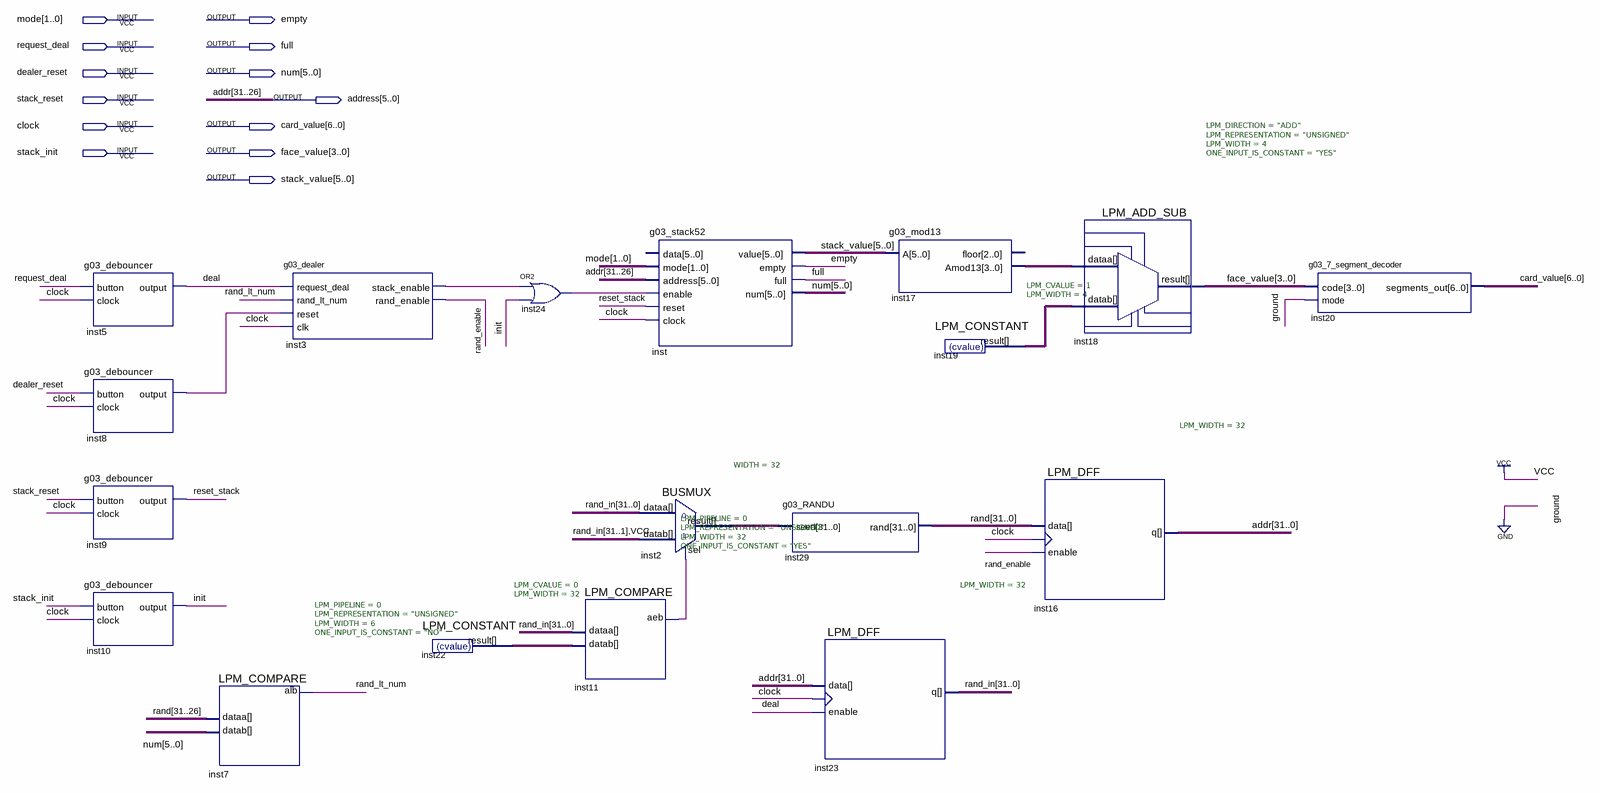
[diagram p0: schematic sheet]
// Quartus schematic g03_testbed_dealer_fixed.bdf as structural Verilog: 18 symbols, 13 pins
module g03_testbed_dealer_fixed (
  input  [1:0] mode,
  input  request_deal,
  input  dealer_reset,
  input  stack_reset,
  input  clock,
  input  stack_init,
  output empty,
  output full,
  output [5:0] num,
  output [5:0] address,
  output [6:0] card_value,
  output [3:0] face_value,
  output [5:0] stack_value
);

  wire deal, init, inst3_stack_enable, inst8_output, inst11_aeb, inst24_out, rand_enable, rand_lt_num,
       reset_stack;
  wire [3:0] inst17_amod13, inst19_result;
  wire [25:0] addr;
  wire [31:0] inst2_result, inst22_result, \rand , rand_in;

  g03_debouncer inst5 (.button(request_deal), .clock(clock), .\output (deal));
  g03_debouncer inst8 (.button(dealer_reset), .clock(clock), .\output (inst8_output));
  g03_debouncer inst9 (.button(stack_reset), .clock(clock), .\output (reset_stack));
  g03_debouncer inst10 (.button(stack_init), .clock(clock), .\output (init));
  LPM_COMPARE #(.LPM_PIPELINE(0), .LPM_REPRESENTATION("UNSIGNED"), .LPM_WIDTH(6), .ONE_INPUT_IS_CONSTANT("NO")) inst7 (
    .dataa(\rand [31:26]), .datab(num), .alb(rand_lt_num));
  g03_dealer inst3 (
    .request_deal(deal), .rand_lt_num(rand_lt_num), .reset(inst8_output), .clk(clock),
    .stack_enable(inst3_stack_enable), .rand_enable(rand_enable));
  LPM_CONSTANT #(.LPM_CVALUE(0), .LPM_WIDTH(32)) inst22 (.result(inst22_result));
  or inst24 (inst24_out, inst3_stack_enable, init);
  LPM_COMPARE #(.LPM_PIPELINE(0), .LPM_REPRESENTATION("UNSIGNED"), .LPM_WIDTH(32), .ONE_INPUT_IS_CONSTANT("YES")) inst11 (
    .dataa(rand_in), .datab(inst22_result), .aeb(inst11_aeb));
  g03_stack52 inst (
    .mode(mode), .address(address), .enable(inst24_out), .reset(reset_stack), .clock(clock),
    .value(stack_value), .empty(empty), .full(full), .num(num));  // open: data
  BUSMUX #(.WIDTH(32)) inst2 (.datab({rand_in[31:1], 1'b1}), .sel(inst11_aeb), .dataa(rand_in), .result(inst2_result));
  g03_RANDU inst29 (.seed(inst2_result), .\rand (\rand ));
  LPM_DFF #(.LPM_WIDTH(32)) inst23 (.clock(clock), .data({address, addr}), .enable(deal), .q(rand_in));
  g03_mod13 inst17 (.A(stack_value), .Amod13(inst17_amod13));  // open: floor
  LPM_CONSTANT #(.LPM_CVALUE(1), .LPM_WIDTH(4)) inst19 (.result(inst19_result));
  LPM_DFF #(.LPM_WIDTH(32)) inst16 (.clock(clock), .data(\rand ), .enable(rand_enable), .q({address, addr}));
  LPM_ADD_SUB #(.LPM_DIRECTION("ADD"), .LPM_REPRESENTATION("UNSIGNED"), .LPM_WIDTH(4), .ONE_INPUT_IS_CONSTANT("YES")) inst18 (
    .dataa(inst17_amod13), .datab(inst19_result), .result(face_value));
  g03_7_segment_decoder inst20 (.code(face_value), .mode(1'b0), .segments_out(card_value));

  // Other names for the same wires on the sheet: addr[31:26] = address
endmodule
